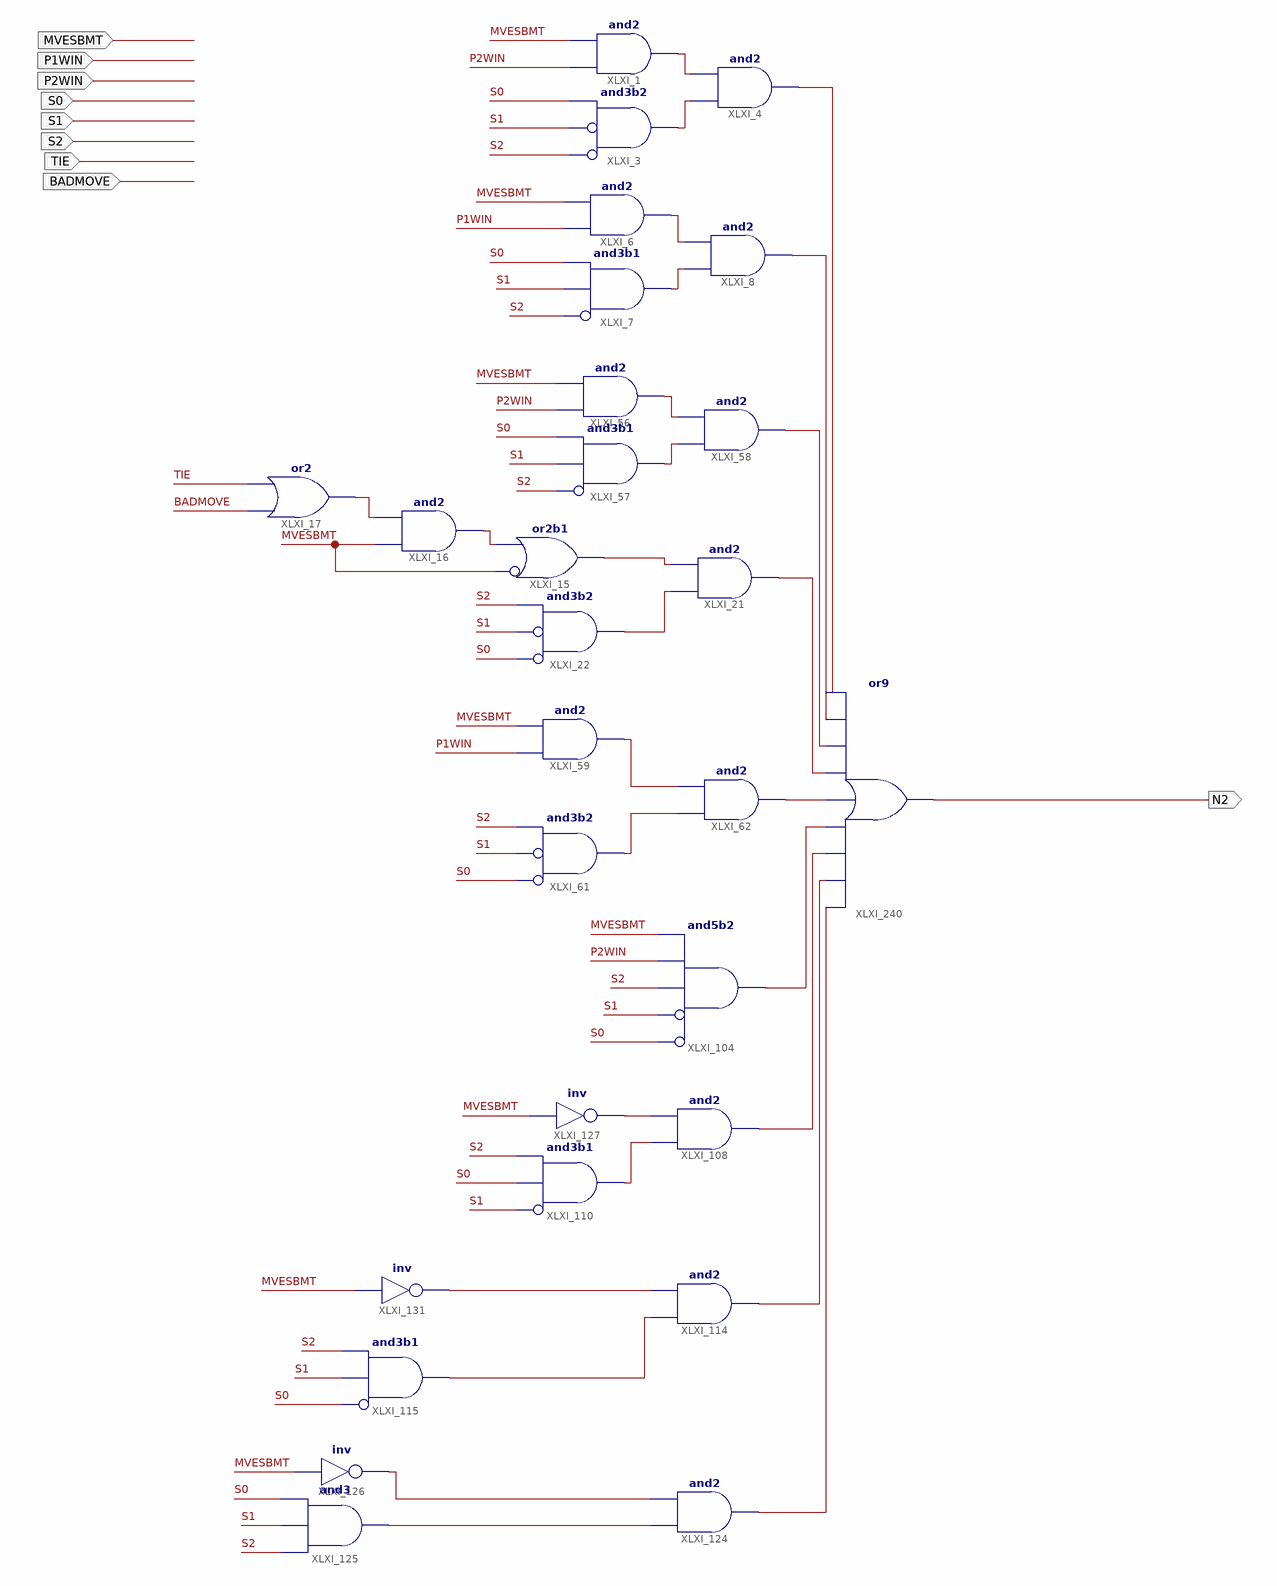
[diagram p0: schematic sheet 1]
// Xilinx ISE schematic N2Logic.sch (spartan6) as structural Verilog: 28 symbols, 9 ports
module N2Logic (
  input  BADMOVE,
  input  TIE,
  input  MVESBMT,
  input  P1WIN,
  input  P2WIN,
  input  S0,
  input  S1,
  input  S2,
  output N2
);

  wire XLXN_28, XLXN_29, XLXN_39, XLXN_41, XLXN_70, XLXN_87, XLXN_89, XLXN_117, XLXN_159, XLXN_160, XLXN_172,
       XLXN_173, XLXN_340, XLXN_341, XLXN_357, XLXN_359, XLXN_404, XLXN_406, XLXN_767, XLXN_768, XLXN_769,
       XLXN_770, XLXN_771, XLXN_772, XLXN_773, XLXN_774, XLXN_775;

  and XLXI_104 (XLXN_770, ~S0, ~S1, S2, P2WIN, MVESBMT);  // and5b2
  and XLXI_110 (XLXN_341, ~S1, S0, S2);  // and3b1
  not XLXI_127 (XLXN_340, MVESBMT);
  and XLXI_114 (XLXN_768, XLXN_359, XLXN_357);
  and XLXI_115 (XLXN_359, ~S0, S1, S2);  // and3b1
  not XLXI_131 (XLXN_357, MVESBMT);
  and XLXI_125 (XLXN_404, S2, S1, S0);
  not XLXI_126 (XLXN_406, MVESBMT);
  and XLXI_124 (XLXN_767, XLXN_404, XLXN_406);
  and XLXI_108 (XLXN_769, XLXN_341, XLXN_340);
  and XLXI_59 (XLXN_172, P1WIN, MVESBMT);
  and XLXI_61 (XLXN_173, ~S0, ~S1, S2);  // and3b2
  or XLXI_17 (XLXN_70, BADMOVE, TIE);
  and XLXI_21 (XLXN_772, XLXN_117, XLXN_89);
  and XLXI_16 (XLXN_87, MVESBMT, XLXN_70);
  or XLXI_15 (XLXN_89, ~MVESBMT, XLXN_87);  // or2b1
  and XLXI_22 (XLXN_117, ~S0, ~S1, S2);  // and3b2
  and XLXI_56 (XLXN_159, P2WIN, MVESBMT);
  and XLXI_57 (XLXN_160, ~S2, S1, S0);  // and3b1
  and XLXI_58 (XLXN_773, XLXN_160, XLXN_159);
  and XLXI_6 (XLXN_39, P1WIN, MVESBMT);
  and XLXI_7 (XLXN_41, ~S2, S1, S0);  // and3b1
  and XLXI_8 (XLXN_774, XLXN_41, XLXN_39);
  and XLXI_3 (XLXN_29, ~S2, ~S1, S0);  // and3b2
  and XLXI_1 (XLXN_28, P2WIN, MVESBMT);
  and XLXI_4 (XLXN_775, XLXN_29, XLXN_28);
  and XLXI_62 (XLXN_771, XLXN_173, XLXN_172);
  or XLXI_240 (N2, XLXN_767, XLXN_768, XLXN_769, XLXN_770, XLXN_771, XLXN_772, XLXN_773, XLXN_774, XLXN_775);
endmodule
